# EAGLE design SO24 (EAGLE 4.14)
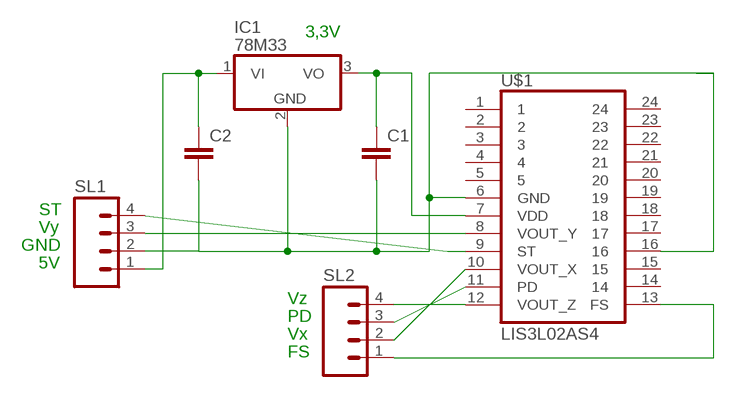
[diagram p0: schematic, sheet 1]

## Parts
C1  C2,5-3  [C2.5-3]
C2  C2,5-3  [C2.5-3]
IC1  78M33  7805T  [TO220H]
SL1  MA04  [04PA]
SL2  MA04  [04PA]
U$1  LIS3L02AS4  [SO24]

## Nets
N$1: SL1.3 U$1.8(VOUT_Y)
N$2: C2.1 IC1.1(VI) SL1.1
N$3: C1.1 IC1.3(VO) U$1.7(VDD)
N$4: SL2.4 U$1.12(VOUT_Z)
N$5: SL2.2 U$1.10(VOUT_X)
N$6: SL2.3 U$1.11(PD)
N$7: SL1.4 U$1.9(ST)
N$8: SL2.1 U$1.13(FS)
N$10: C1.2 C2.2 IC1.2(GND) SL1.2 U$1.6(GND) U$1.16
Unconnected: U$1.1 U$1.2 U$1.3 U$1.4 U$1.5 U$1.14 U$1.15 U$1.17 U$1.18 U$1.19 U$1.20 U$1.21 U$1.22 U$1.23 U$1.24

## Notes on the sheet
- 3,3V
- ST
- Vy
- GND
- 5V
- Vz
- PD
- Vx
- FS

## Library data of the parts
C1 C2 = capacitor-wima:C: CAPACITOR naming: grid - package width
IC1 = linear:78*: Positive VOLTAGE REGULATOR Source: http://cache.national.com/ds/LM/LM78L05.pdf http://www.fairchildsemi.com/ds/LM/LM7805.pdf
SL1 SL2 = con-amp-quick:MA04: AMP QUICK CONNECTOR
U$1 = LIS3L02AS4:LIS3L02AS4

## Board
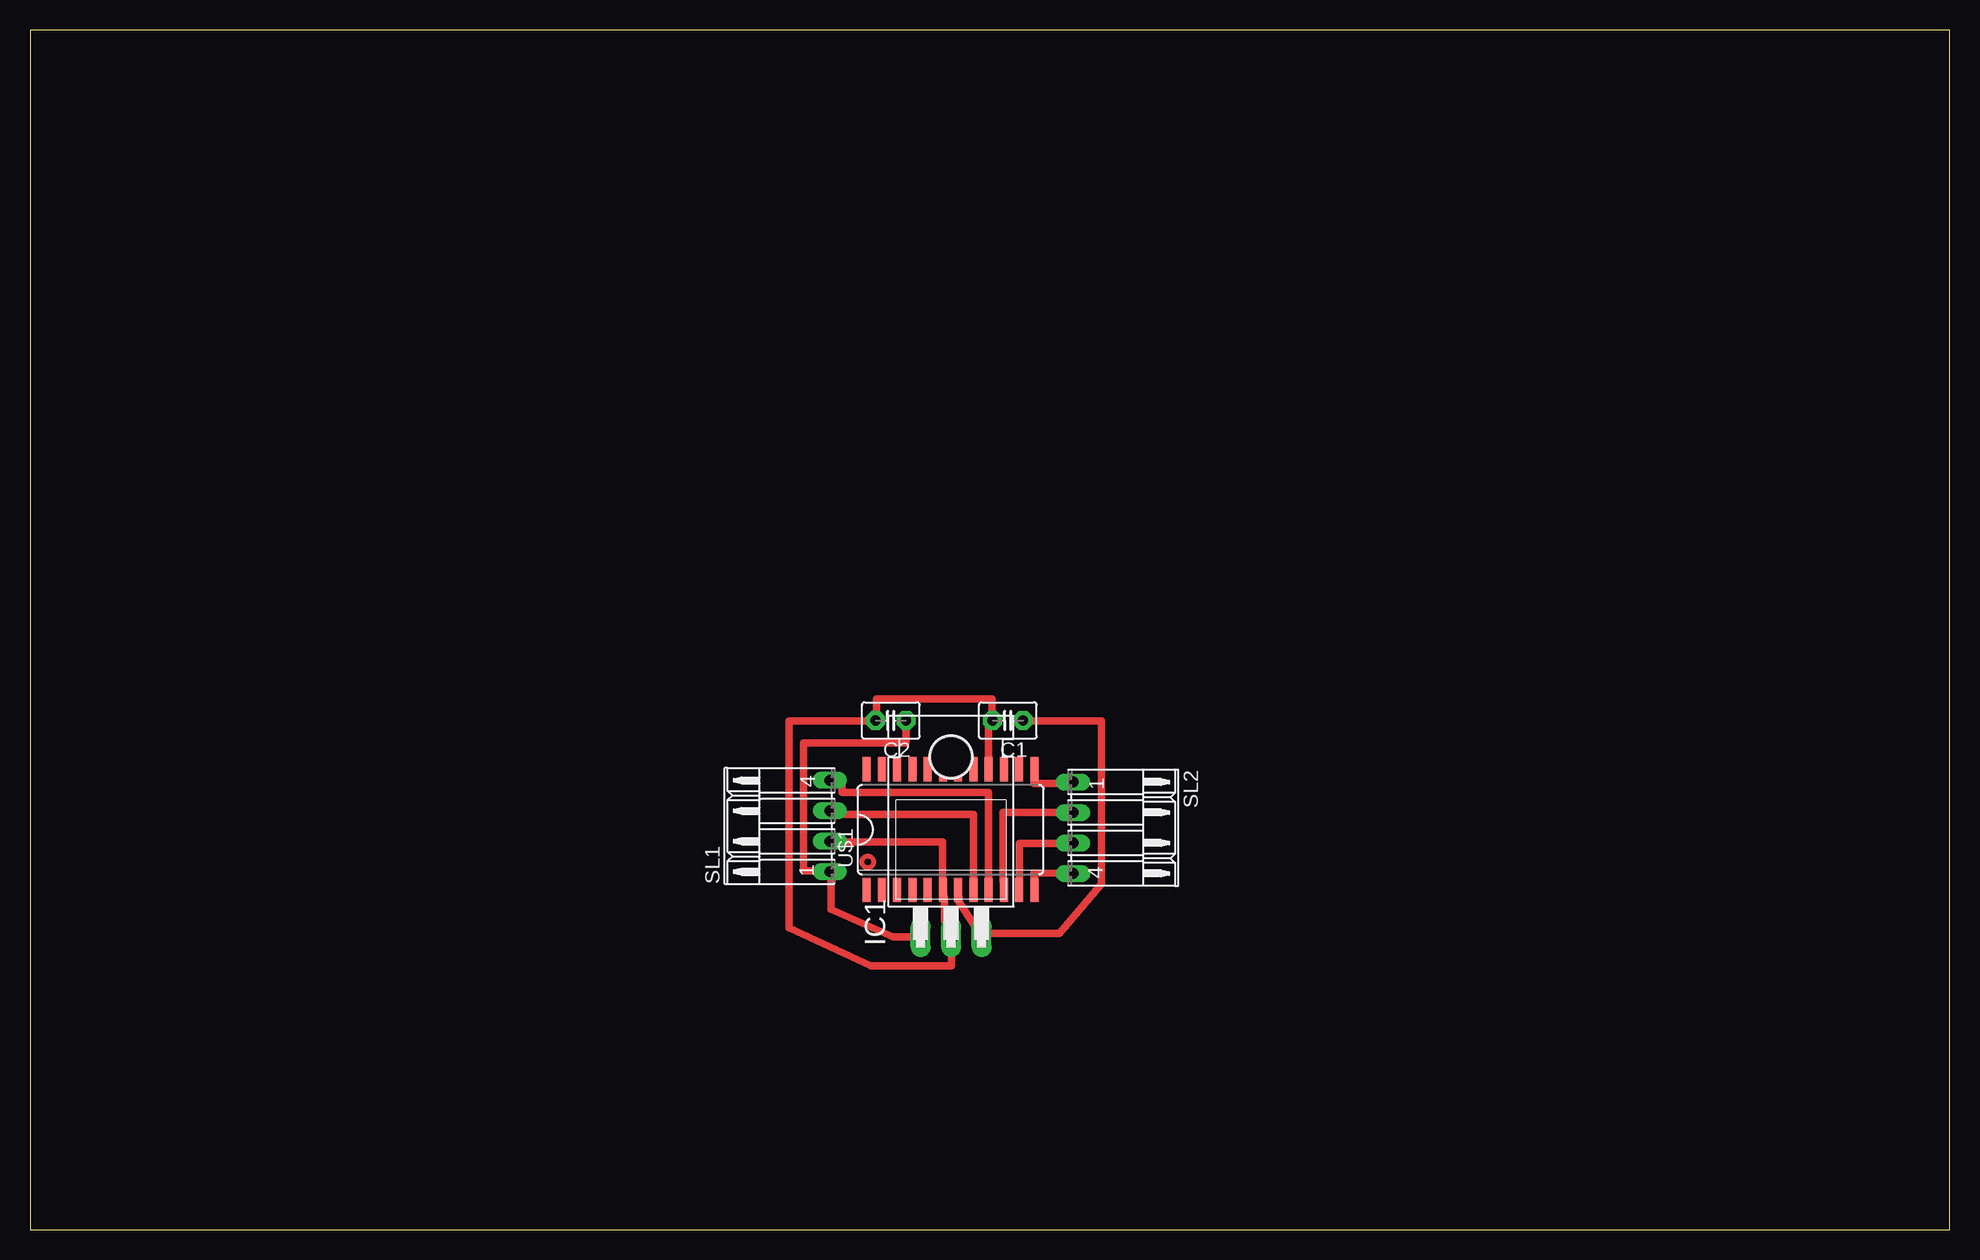
[diagram p1: board, top side]

Size 160 x 100 mm. Coordinates in mm from the lower left corner, seen from the top.
Outline: 0,0 160,0 160,100 0,100 0,0
Copper layers (1*16): Top 0.035mm / dielectric 1.5mm / Bottom 0.035mm
Design rules "default": minimum track width 24mil, minimum drill 24mil, track to track 8mil, track to pad 8mil, pad to pad 8mil, via to via 8mil, smd to smd 8mil, copper to edge 40mil, drill to drill 8mil, minimum pad ring 10mil, minimum via ring 8mil, stop-mask expansion 4mil, vias tented up to drill 0mil, thermal gap 10mil

### Footprints (pad centres in the part's own frame; a part is rotated, then mirrored left to right if it is on the bottom)
C2.5-3 = drill 0.813 pad 1.6 octagon: 1 -1.27,0; 2 1.27,0
TO220H = drill 1.118 long: 1 -2.54,-10.16; 2 0,-10.16; 3 2.54,-10.16 | hole 3.302: 0,4.826
04PA = drill 0.914 long: 1 -3.81,0; 2 -1.27,0; 3 1.27,0; 4 3.81,0
SO24 = smd 0.66 x 2.032: 1 -8.255,-5.029; 2 -6.985,-5.029; 3 -5.715,-5.029; 4 -4.445,-5.029; 5 -3.175,-5.029; 6 -1.905,-5.029; 7 -0.635,-5.029; 8 0.635,-5.029; 9 1.905,-5.029; 10 3.175,-5.029; 11 4.445,-5.029; 12 5.715,-5.029; 13 5.715,5.029; 14 4.445,5.029; 15 3.175,5.029; 16 1.905,5.029; 17 0.635,5.029; 18 -0.635,5.029; 19 -1.905,5.029; 20 -3.175,5.029; 21 -4.445,5.029; 22 -5.715,5.029; 23 -6.985,5.029; 24 -8.255,5.029

### Placement (x,y rotation side)
C1  81.5,42.43 180 top
C2  71.75,42.43 180 top
IC1  76.78,34.56 0 top
SL1  66.67,33.64 90 top
SL2  86.94,33.49 270 top
U$1  78,33.34 0 top

### Tracks (layer width: path | path; a pad name or v marks a point on that pad's centre or on a via)
N$1
  Top 0.61: U$1.8 78.66,29.12 78.66,34.61 67.99,34.61 SL1.3
N$2
  Top 0.61: IC1.1 71.95,24.4 66.77,26.68 66.77,29.58 SL1.1 66.92,29.88 64.49,29.88 64.49,40.55 73.02,40.55 C2.1
N$3
  Top 0.61: U$1.7 77.44,27.6 77.44,27.29 78.66,25.46 IC1.3 79.73,24.7 85.82,24.7 89.33,28.82 89.33,42.38 83.54,42.38 C1.1
N$4
  Top 0.61: U$1.12 83.69,29.12 83.69,29.73 SL2.4
N$5
  Top 0.61: U$1.10 81.1,29.12 81.1,34.76 SL2.2
N$6
  Top 0.61: U$1.11 82.47,29.12 82.47,32.17 85.52,32.17 SL2.3
N$7
  Top 0.61: U$1.9 79.88,29.12 79.88,36.44 67.69,36.44 67.69,37.05 SL1.4
N$8
  Top 0.61: U$1.13 83.69,37.2 85.52,37.2 SL2.1
N$10
  Top 0.61: U$1.16 79.88,39.18 79.88,41.92 C1.2 80.18,43.14 80.18,44.21 70.58,44.21 70.58,42.84 C2.2 69.82,42.38 63.27,42.38 63.27,25.16 70.12,21.96 76.83,21.96 76.83,23.02 IC1.2 76.22,25.77 76.22,27.6 U$1.6 76.07,29.43 76.07,32.32 67.99,32.32 SL1.2
(copper drawn outside any net)
  shapes: Top circle x1